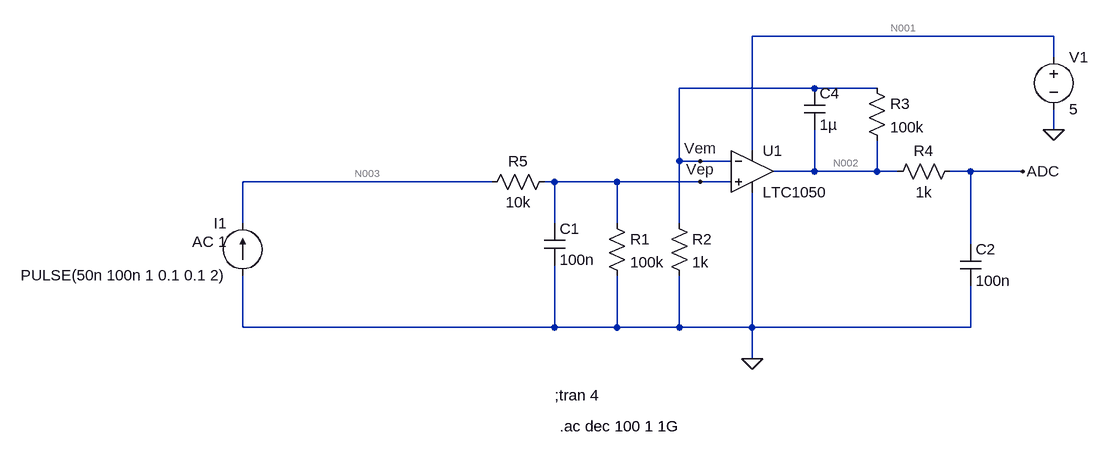
[diagram p0: schematic Ampli.asc]
Ampli.asc, the LTspice schematic file:
Version 4
SHEET 1 880 680
WIRE 800 -416 336 -416
WIRE 800 -384 800 -416
WIRE 432 -336 224 -336
WIRE 528 -336 432 -336
WIRE 800 -272 800 -304
WIRE 336 -240 336 -416
WIRE 224 -224 224 -336
WIRE 256 -224 224 -224
WIRE 304 -224 256 -224
WIRE 432 -208 432 -272
WIRE 432 -208 368 -208
WIRE 528 -208 528 -256
WIRE 528 -208 432 -208
WIRE 560 -208 528 -208
WIRE 672 -208 640 -208
WIRE 752 -208 672 -208
WIRE -64 -192 -448 -192
WIRE 32 -192 16 -192
WIRE 128 -192 32 -192
WIRE 256 -192 128 -192
WIRE 304 -192 256 -192
WIRE -448 -128 -448 -192
WIRE 32 -128 32 -192
WIRE 128 -128 128 -192
WIRE 224 -128 224 -224
WIRE 672 -96 672 -208
WIRE -448 32 -448 -48
WIRE 32 32 32 -64
WIRE 32 32 -448 32
WIRE 128 32 128 -48
WIRE 128 32 32 32
WIRE 224 32 224 -48
WIRE 224 32 128 32
WIRE 336 32 336 -176
WIRE 336 32 224 32
WIRE 672 32 672 -32
WIRE 672 32 336 32
WIRE 336 80 336 32
FLAG 336 80 0
FLAG 800 -272 0
FLAG 256 -224 Vem
FLAG 256 -192 Vep
FLAG 752 -208 ADC
SYMBOL res 112 -144 R0
SYMATTR InstName R1
SYMATTR Value 100k
SYMBOL res 208 -144 R0
SYMATTR InstName R2
SYMATTR Value 1k
SYMBOL cap 16 -128 R0
SYMATTR InstName C1
SYMATTR Value 100n
SYMBOL OpAmps\\LTC1050 336 -272 R0
SYMATTR InstName U1
SYMBOL cap 656 -96 R0
SYMATTR InstName C2
SYMATTR Value 100n
SYMBOL cap 416 -336 R0
SYMATTR InstName C4
SYMATTR Value 1µ
SYMBOL res 512 -352 R0
SYMATTR InstName R3
SYMATTR Value 100k
SYMBOL res 656 -224 R90
WINDOW 0 0 56 VBottom 2
WINDOW 3 32 56 VTop 2
SYMATTR InstName R4
SYMATTR Value 1k
SYMBOL res 32 -208 R90
WINDOW 0 0 56 VBottom 2
WINDOW 3 32 56 VTop 2
SYMATTR InstName R5
SYMATTR Value 10k
SYMBOL voltage 800 -400 R0
WINDOW 123 0 0 Left 0
WINDOW 39 0 0 Left 0
SYMATTR InstName V1
SYMATTR Value 5
SYMBOL current -448 -48 R180
WINDOW 0 24 80 Left 2
WINDOW 3 24 0 Left 2
WINDOW 123 24 52 Left 2
WINDOW 39 0 0 Left 0
SYMATTR InstName I1
SYMATTR Value PULSE(50n 100n 1 0.1 0.1 2)
SYMATTR Value2 AC 1
TEXT 32 136 Left 2 !;tran 4
TEXT 40 184 Left 2 !.ac dec 100 1 1G

The netlist it stands for:
* Ampli.asc
R1 Vep 0 100k
R2 Vem 0 1k
C1 Vep 0 100n
XU1 Vep Vem N001 0 N002 LTC1050  ; pins In+ In- V+ V- OUT
C2 ADC 0 100n
C4 Vem N002 1µ
R3 Vem N002 100k
R4 ADC N002 1k
R5 Vep N003 10k
V1 N001 0 5
I1 0 N003 PULSE(50n 100n 1 0.1 0.1 2) AC 1
;tran 4
.ac dec 100 1 1G
.lib LTC.lib
.backanno
.end

* Results of the author's LTspice run, read from the files saved beside the schematic
* Operating Point, zero values left out:
*   V(vep) = 5 mV
*   V(vem) = 5 mV
*   V(n001) = 5 V
*   V(n002) = 505 mV
*   V(adc) = 505 mV
*   V(n003) = 5.5 mV
*   I(I1) = 50 nA
*   I(R1) = 50 nA
*   I(R2) = 5 µA
*   I(R3) = -5 µA
*   I(R5) = -50 nA
*   I(V1) = -754.1 µA
*   Ix(u1:3) = 754.1 µA
*   Ix(u1:4) = -749.1 µA
*   Ix(u1:5) = -5 µA
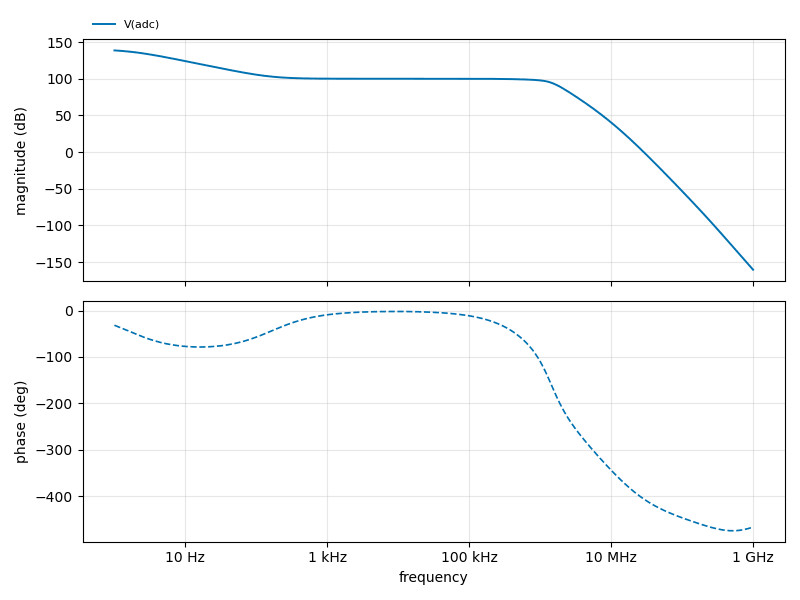
[diagram p1: AC Analysis of Ampli.asc, plotted from the saved traces]
* AC Analysis, 1 run:
*   V(adc): 138.64 dB at 1 Hz, -160.24 dB at 1 GHz, peak 138.64 dB at 1 Hz, 3 dB below the peak at 2.129 Hz